# EAGLE design Doorlock (EAGLE 9.1.3)
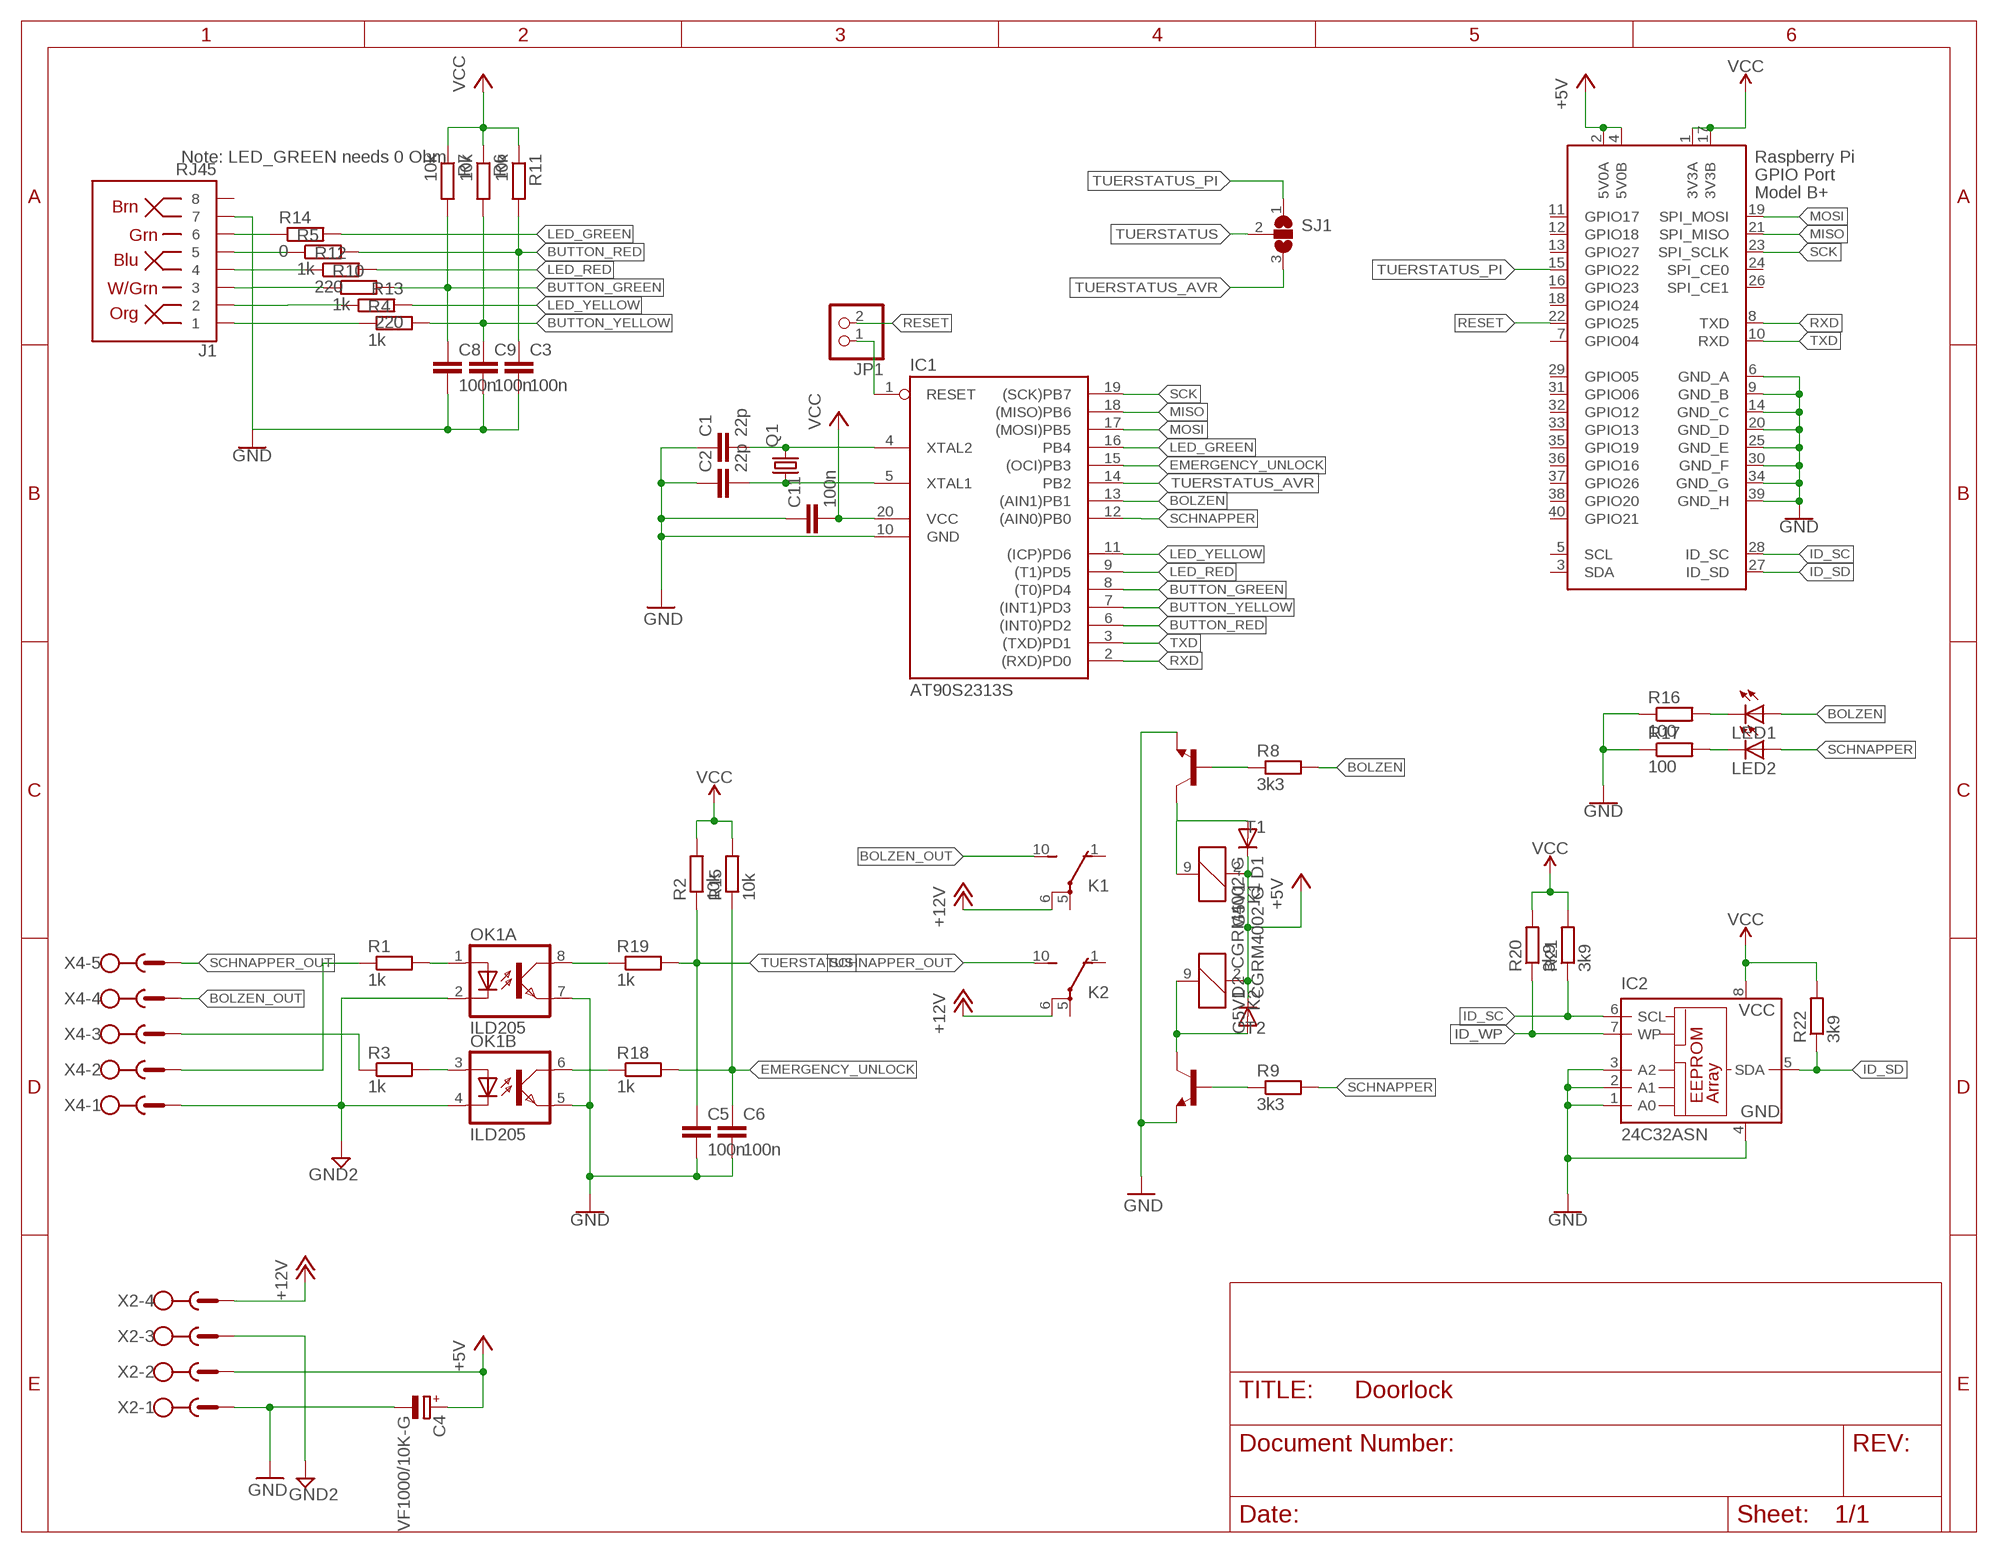
[diagram p0: schematic, sheet 1]

## Parts
C1  22p  C-EUC0805  [C0805]
C2  22p  C-EUC0805  [C0805]
C3  100n  C-EUC0805  [C0805]
C4  VF1000/10K-G  CPOL-EUUD-10X10  [UD-10X10_NICHICON]
C5  100n  C-EUC0805  [C0805]
C6  100n  C-EUC0805  [C0805]
C8  100n  C-EUC0805  [C0805]
C9  100n  C-EUC0805  [C0805]
C11  100n  C-EUC0805  [C0805]
D1  CGRM4002-G  [SOD-123_MINI-SMA]
D2  CGRM4002-G  [SOD-123_MINI-SMA]
IC1  AT90S2313S  [SO20L]
IC2  24C32ASN  [SO-08]
J1  RJ45  RJ45-8  [RJ45-8]
JP1  PINHD-1X2  [1X02]
K1  G5V1  [G5V1]
K2  G5V1  [G5V1]
LED1  LEDCHIP-LED0805  [CHIP-LED0805]
LED2  LEDCHIP-LED0805  [CHIP-LED0805]
OK1  ILD205  [SOIC08]
Q1  CRYSTALHC49UP  [HC49UP]
R1  1k  R-EU_R0805  [R0805]
R2  10k  R-EU_R0805  [R0805]
R3  1k  R-EU_R0805  [R0805]
R4  1k  R-EU_R0805  [R0805]
R5  1k  R-EU_R0805  [R0805]
R6  10k  R-EU_R0805  [R0805]
R7  10k  R-EU_R0805  [R0805]
R8  3k3  R-EU_R0805  [R0805]
R9  3k3  R-EU_R0805  [R0805]
R10  1k  R-EU_R0805  [R0805]
R11  10k  R-EU_R0805  [R0805]
R12  220  R-EU_R0805  [R0805]
R13  220  R-EU_R0805  [R0805]
R14  0  R-EU_R0805  [R0805]
R15  10k  R-EU_R0805  [R0805]
R16  100  R-EU_R0805  [R0805]
R17  100  R-EU_R0805  [R0805]
R18  1k  R-EU_R0805  [R0805]
R19  1k  R-EU_R0805  [R0805]
R20  3k9  R-EU_R0805  [R0805]
R21  3k9  R-EU_R0805  [R0805]
R22  3k9  R-EU_R0805  [R0805]
SJ1  SJ2W  [SJ_2]
T1  BC817-16-NPN-SOT23-BEC  [SOT23-BEC]
T2  BC817-16-NPN-SOT23-BEC  [SOT23-BEC]
X1  RASPI_BOARD_B+#_H  [RASPI_BOARD_B+HAT]
X2  RIA182-04  [RIA182-04]
X4  RIA182-05  [RIA182-05]

## Nets
+5V: C4.+ D1.C D2.C K1.2 K2.2 X1.2(5V0A) X1.4(5V0B) X2.2
+12V: K1.6(2:P) K2.6(2:P) X2.4
BOLZEN: IC1.13((AIN1)PB1) LED1.A R8.2
BOLZEN_OUT: K1.10(2:S) X4.4
BUTTON_GREEN: C8.1 IC1.8((T0)PD4) R7.2 R10.2
BUTTON_RED: C3.1 IC1.6((INT0)PD2) R5.2 R11.2
BUTTON_YELLOW: C9.1 IC1.7((INT1)PD3) R4.2 R6.2
EMERGENCY_UNLOCK: C6.1 IC1.15((OCI)PB3) R15.1 R18.2
GND: C1.1 C2.1 C3.2 C4.- C5.2 C6.2 C8.2 C9.2 C11.1 IC1.10(GND) IC2.1(A0) IC2.2(A1) IC2.3(A2) IC2.4(GND) J1.7 OK1.5(B:EMIT) OK1.7(A:EMIT) R16.1 R17.1 T1.E T2.E X1.6(GND_A) X1.9(GND_B) X1.14(GND_C) X1.20(GND_D) X1.25(GND_E) X1.30(GND_F) X1.34(GND_G) X1.39(GND_H) X2.1
GND2: OK1.2(A:C) OK1.4(B:C) X2.3 X4.1
ID_SC: IC2.6(SCL) R21.1 X1.28(ID_SC)
ID_SD: IC2.5(SDA) R22.1 X1.27(ID_SD)
ID_WP: IC2.7(WP) R20.1
LED_GREEN: IC1.16(PB4) R14.2
LED_RED: IC1.9((T1)PD5) R12.2
LED_YELLOW: IC1.11((ICP)PD6) R13.1
MISO: IC1.18((MISO)PB6) X1.21(SPI_MISO)
MOSI: IC1.17((MOSI)PB5) X1.19(SPI_MOSI)
N$1: IC1.1(RESET) JP1.1
N$2: J1.6 R14.1
N$3: OK1.6(B:COL) R18.1
N$4: OK1.3(B:A) R3.2
N$5: OK1.8(A:COL) R19.1
N$6: C1.2 IC1.4(XTAL2) Q1.2
N$7: C2.2 IC1.5(XTAL1) Q1.1
N$8: J1.3 R10.1
N$9: J1.4 R12.1
N$10: R1.1 X4.2
N$11: J1.2 R13.2
N$13: R3.1 X4.3
N$14: OK1.1(A:A) R1.2
N$16: LED1.C R16.2
N$17: LED2.C R17.2
N$20: J1.1 R4.1
N$21: J1.5 R5.1
N$24: D2.A K2.9 T2.C
N$25: D1.A K1.9 T1.C
N$27: R8.1 T1.B
N$28: R9.1 T2.B
RESET: JP1.2 X1.22(GPIO25)
RXD: IC1.2((RXD)PD0) X1.8(TXD)
SCHNAPPER: IC1.12((AIN0)PB0) LED2.A R9.2
SCHNAPPER_OUT: K2.10(2:S) X4.5
SCK: IC1.19((SCK)PB7) X1.23(SPI_SCLK)
TUERSTATUS: C5.1 R2.1 R19.2 SJ1.2
TUERSTATUS_AVR: IC1.14(PB2) SJ1.3
TUERSTATUS_PI: SJ1.1 X1.15(GPIO22)
TXD: IC1.3((TXD)PD1) X1.10(RXD)
VCC: C11.2 IC1.20(VCC) IC2.8(VCC) R2.2 R6.1 R7.1 R11.1 R15.2 R20.2 R21.2 R22.2 X1.1(3V3A) X1.17(3V3B)
Unconnected: J1.8 K1.1(2:O) K1.5(2:P) K2.1(2:O) K2.5(2:P) X1.3(SDA) X1.5(SCL) X1.7(GPIO04) X1.11(GPIO17) X1.12(GPIO18) X1.13(GPIO27) X1.16(GPIO23) X1.18(GPIO24) X1.24(SPI_CE0) X1.26(SPI_CE1) X1.29(GPIO05) X1.31(GPIO06) X1.32(GPIO12) X1.33(GPIO13) X1.35(GPIO19) X1.36(GPIO16) X1.37(GPIO26) X1.38(GPIO20) X1.40(GPIO21)

## Notes on the sheet
- Note: LED_GREEN needs 0 Ohm

## Library data of the parts
C1-C3 C5 C6 C8 C9 C11 = rcl:C-EU: CAPACITOR, European symbol
C4 = rcl:CPOL-EU: POLARIZED CAPACITOR, European symbol
D1 D2 = diode:CGRM400*-G: Molded plasitc,JEDEC SOD-123/Mini SMA Source: Comchip CGRM4001-G.pdf
IC1 = atmel:AT90S2313: MICROCONTROLLER 2 Kbytes FLASH 128 bytes SRAM 128 bytes EEPROM UART; OC_FARNELL: unknown; OC_NEWARK: unknown
IC2 = microchip:24*: Serial EEPROM I2C; MPN: IS24C32A-2GLI; OC_FARNELL: 1224413; OC_NEWARK: 43M4588
J1 = SparkFun-Connectors:RJ45-8: RJ45 Jack - 8 pin Simple RJ45, 8-pin connection. Commonly used for Cat5, Cat5e, and Cat6 Ethernet cables. Here is the connector we sell at SparkFun: RJ45 8-Pin Connector <https://www.sparkfun.com/products/643> (PRT-00643) Datasheet <https://cdn.sparkfun.com/datasheets/Prototyping/04908.pdf> It is used on this SparkFun product: SparkFun RJ45 Breakout <https://www.sparkfun.com/products/716> (BOB-00716) Note, you may also be interested in the "MAGJACK" version of this. It is basically a RJ45 connector, but also has some status LEDs built into the connector housing. You can check that out in this library at the device named "MAGJACK.dev" and see these products online: RJ45 Ethernet MagJack-Compatible <https://www.sparkfun.com/products/8534> (PRT-08534) SparkFun RJ45 MagJack Breakout <https://www.sparkfun.com/products/13021> (BOB-13021); PROD_ID: CONN-08506; SF_ID: PRT-00643
JP1 = pinhead:PINHD-1X2: PIN HEADER
K1 K2 = relay:G5V1: RELAY 1 x switch, 0.5 A/125 V AC, 1 A/24 V DC , Omron; MPN: G5V-1-DC24; OC_FARNELL: 9949593; OC_NEWARK: 36M6377
LED1 LED2 = led:LED: LED OSRAM: - CHIPLED LG R971, LG N971, LY N971, LG Q971, LY Q971, LO R971, LY R971 LH N974, LH R974 LS Q976, LO Q976, LY Q976 LO Q996 - Hyper CHIPLED LW Q18S LB Q993, LB Q99A, LB R99A - SideLED LS A670, LO A670, LY A670, LG A670, LP A670 LB A673, LV A673, LT A673, LW A673 LH A674 LY A675 LS A676, LA A676, LO A676, LY A676, LW A676 LS A679, LY A679, LG A679 - Hyper Micro SIDELED® LS Y876, LA Y876, LO Y876, LY Y876 LT Y87S - SmartLED LW L88C, LW L88S LB L89C, LB L89S, LG L890 LS L89K, LO L89K, LY L89K LS L896, LA L896, LO L896, LY L896 - TOPLED LS T670, LO T670, LY T670, LG T670, LP T670 LSG T670, LSP T670, LSY T670, LOP T670, LYG T670 LG T671, LOG T671, LSG T671 LB T673, LV T673, LT T673, LW T673 LH T674 LS T676, LA T676, LO T676, LY T676, LB T676, LH T676, LSB T676, LW T676 LB T67C, LV T67C, LT T67C, LS T67K, LO T67K, LY T67K, LW E67C LS E67B, LA E67B, LO E67B, LY E67B, LB E67C, LV E67C, LT E67C LW T67C LS T679, LY T679, LG T679 LS T770, LO T770, LY T770, LG T770, LP T770 LB T773, LV T773, LT T773, LW T773 LH T774 LS E675, LA E675, LY E675, LS T675 LS T776, LA T776, LO T776, LY T776, LB T776 LHGB T686 LT T68C, LB T68C - Hyper Mini TOPLED® LB M676 - Mini TOPLED Santana® LG M470 LS M47K, LO M47K, LY M47K Source: http://www.osram.convergy.de LUXEON: - LUMILED® LXK2-PW12-R00, LXK2-PW12-S00, LXK2-PW14-U00, LXK2-PW14-V00 LXK2-PM12-R00, LXK2-PM12-S00, LXK2-PM14-U00 LXK2-PE12-Q00, LXK2-PE12-R00, LXK2-PE12-S00, LXK2-PE14-T00, LXK2-PE14-U00 LXK2-PB12-K00, LXK2-PB12-L00, LXK2-PB12-M00, LXK2-PB14-N00, LXK2-PB14-P00, LXK2-PB14-Q00 LXK2-PR12-L00, LXK2-PR12-M00, LXK2-PR14-Q00, LXK2-PR14-R00 LXK2-PD12-Q00, LXK2-PD12-R00, LXK2-PD12-S00 LXK2-PH12-R00, LXK2-PH12-S00 LXK2-PL12-P00, LXK2-PL12-Q00, LXK2-PL12-R00 Source: www.luxeon.com KINGBRIGHT: KA-3528ASYC Source: www.kingbright.com
OK1 = optocoupler:ILD2*: Siemens ILD205/206/207/211/213/217 DUAL PHOTOTRANSISTOR SMALL OUTLINE SURFACE MOUNT OPTOCOUPLER Source: 153385-da-01-en-Optocoupler_ILD205-T.pdf; MF: VISHAY/TELEFUNKEN; MPN: ILD205T; OC_FARNELL: 1469512; OC_NEWARK: 20H8678
Q1 = crystal:CRYSTAL: CRYSTAL; OC_FARNELL: unknown; OC_NEWARK: unknown
R1-R22 = rcl:R-EU_: RESISTOR, European symbol
SJ1 = jumper:SJ2W: SMD solder JUMPER
T1 T2 = transistor:*-NPN-: NPN Transistror BF959 corrected 2008.03.06
X1 = raspberrypi_bastelstube_v13:RASPI_BOARD_B+#: Raspberry Pi GPIO connector with markings for the outer dimensions of the Raspberry Pi board model B+ with different sets of drill holes or mounting pads All pins connected
X2 = con-ria182:RIA182-04: Gewinkelter Wannenstecker 4-polig Rastermaß: 3,5mm Lötstift / Steckerstift: 1x1mm Bohrung: 1,5mm Bemessungsstrom: 5A Nennquerschnitt Stecker: 1,5qmm eindrähtig / 1qmm feinstdrähtig
X4 = con-ria182:RIA182-05: Gewinkelter Wannenstecker 5-polig Rastermaß: 3,5mm Lötstift / Steckerstift: 1x1mm Bohrung: 1,5mm Bemessungsstrom: 5A Nennquerschnitt Stecker: 1,5qmm eindrähtig / 1qmm feinstdrähtig

## Board
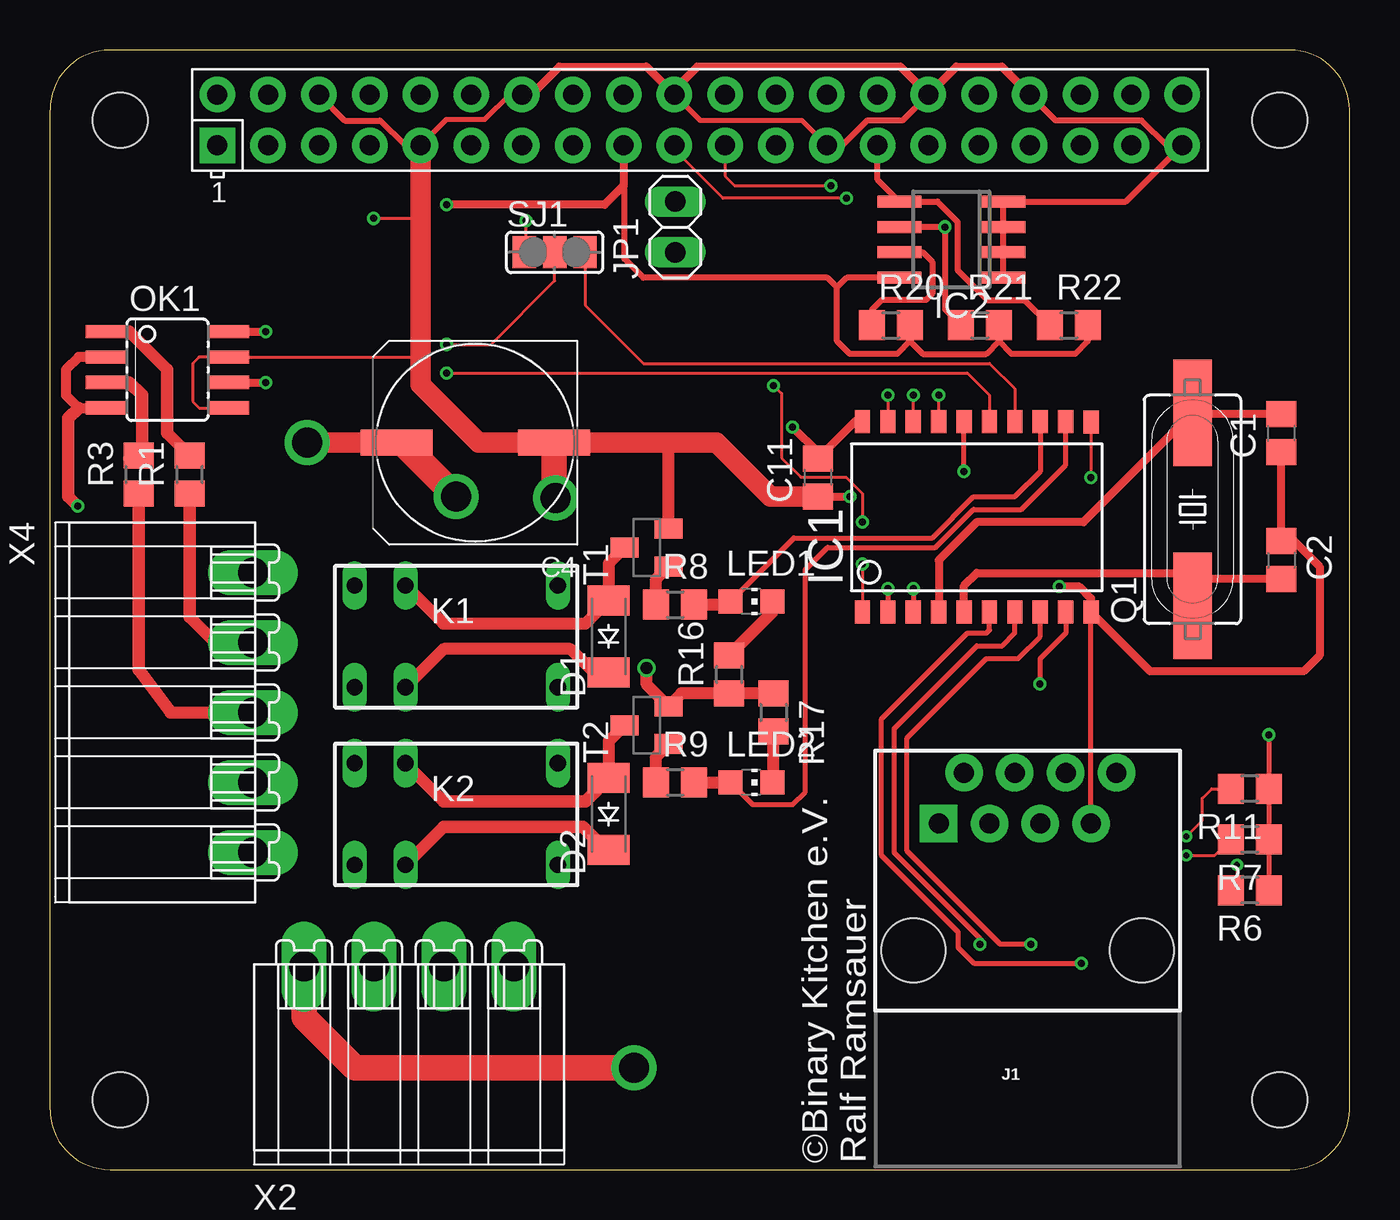
[diagram p1: board, top side]
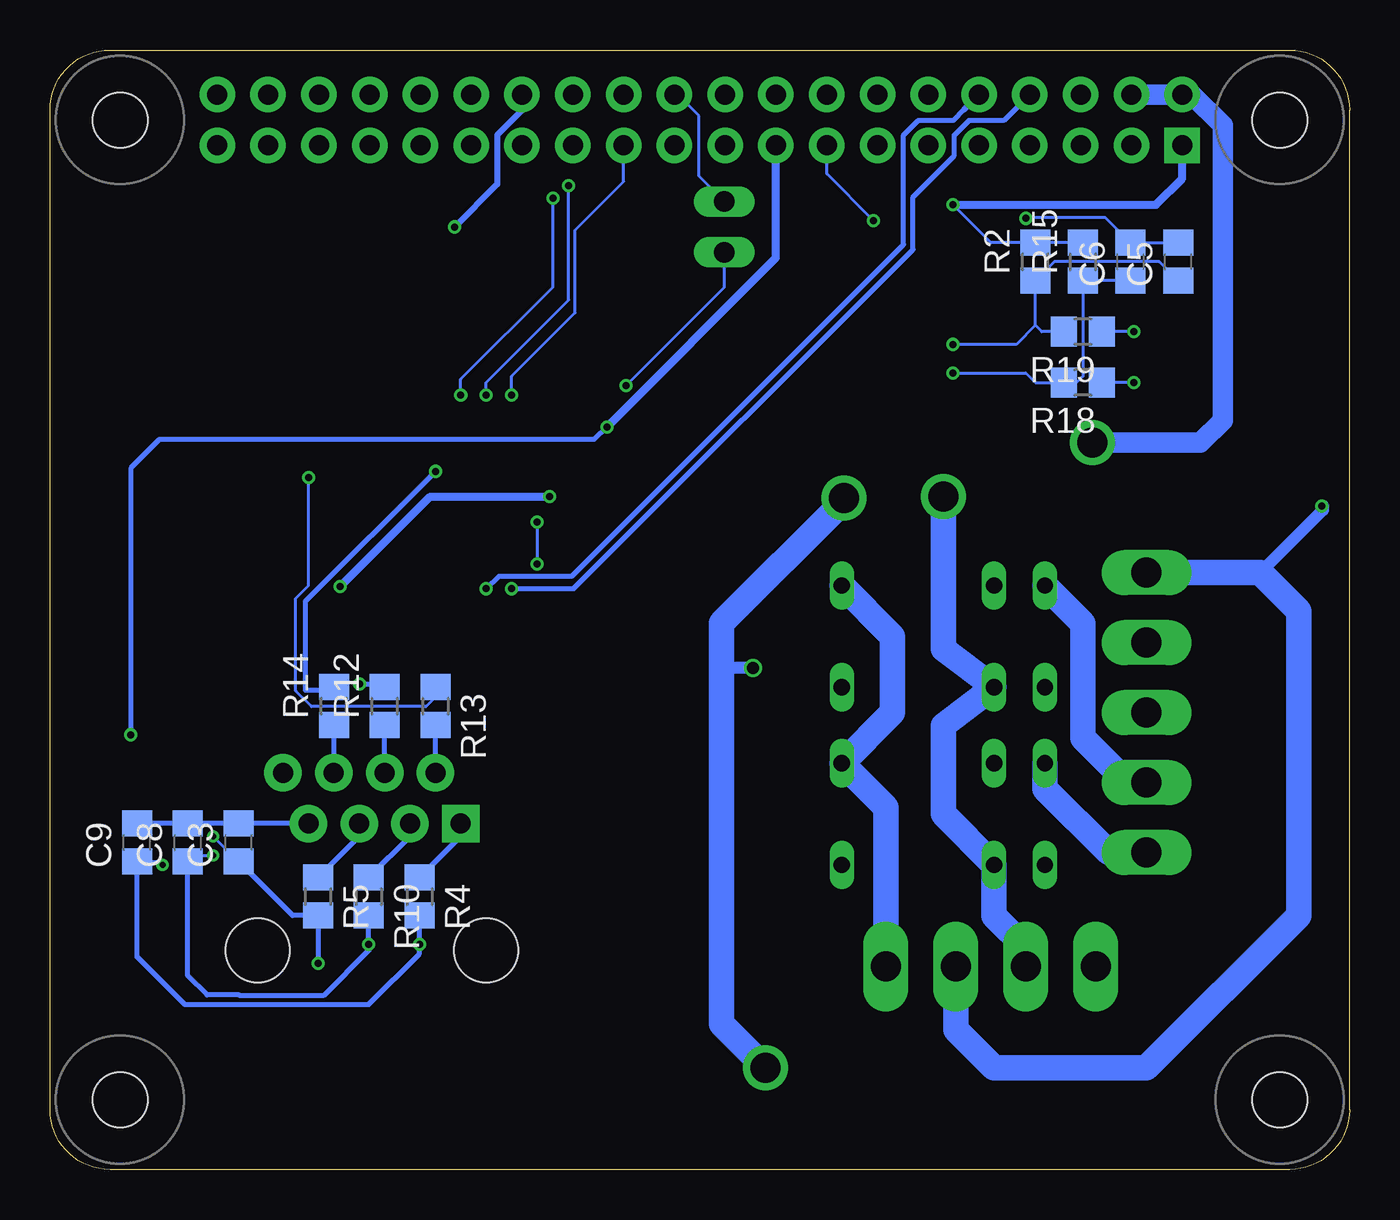
[diagram p2: board, bottom side, seen from below]

Size 65 x 56 mm. Coordinates in mm from the lower left corner, seen from the top.
Copper layers (1*16): Top 0.035mm / dielectric 1.6mm / Bottom 0.035mm
Design rules "Elecrow_2-layer_PCB_eagle_rule": minimum track width 6mil, minimum drill 12mil, track to track 6mil, track to pad 8mil, pad to pad 12mil, via to via 12mil, smd to smd 0mil, copper to edge 20mil, drill to drill 10mil, minimum pad ring 6mil, minimum via ring 6mil, stop-mask expansion 0mil, vias tented up to drill 100mil, thermal gap 10mil

### Footprints (pad centres in the part's own frame; a part is rotated, then mirrored left to right if it is on the bottom)
C0805 = smd 1.3 x 1.5: 1 -0.95,0; 2 0.95,0
UD-10X10_NICHICON = smd 3.6 x 1.3: + 3.925,0; - -3.95,0
SOD-123_MINI-SMA = smd 1.5 x 2.1: A 1.8,0; C -1.8,0
SO20L = smd 0.762 x 1.143: 1 -5.08,-5.131; 2 -3.81,-5.131; 3 -2.54,-5.131; 4 -1.27,-5.131; 5 0,-5.131; 6 1.27,-5.131; 7 2.54,-5.131; 8 3.81,-5.131; 9 5.08,-5.131; 10 6.35,-5.131; 11 6.35,4.369; 12 5.08,4.394; 13 3.81,4.394; 14 2.54,4.394; 15 1.27,4.394; 16 0,4.394; 17 -1.27,4.394; 18 -2.54,4.394; 19 -3.81,4.394; 20 -5.08,4.394
SO-08 = smd 0.6 x 2.2: 1 -1.905,-2.6; 2 -0.635,-2.6; 3 0.635,-2.6; 4 1.905,-2.6; 5 1.905,2.6; 6 0.635,2.6; 7 -0.635,2.6; 8 -1.905,2.6
RJ45-8 = drill 1 pad 1.88 square: 1 -4.445,6.35 | drill 1 pad 1.88: 2 -3.175,8.89; 3 -1.905,6.35; 4 -0.635,8.89; 5 0.635,6.35; 6 1.905,8.89; 7 3.175,6.35; 8 4.445,8.89 | hole 3.2: -5.715,0; 5.715,0
1X02 = drill 1.016 long: 1 -1.27,0; 2 1.27,0
G5V1 = drill 0.813 long: 1 -5.08,-2.54; 2 -2.54,-2.54; 5 5.08,-2.54; 6 5.08,2.54; 9 -2.54,2.54; 10 -5.08,2.54
CHIP-LED0805 = smd 1.2 x 1.2: A 0,-1.05; C 0,1.05
SOIC08 = smd 0.66 x 2.032: 1 -1.905,-3.073; 2 -0.635,-3.073; 3 0.635,-3.073; 4 1.905,-3.073; 5 1.905,3.073; 6 0.635,3.073; 7 -0.635,3.073; 8 -1.905,3.073
HC49UP = smd 5.334 x 1.93: 1 -4.826,0; 2 4.826,0
R0805 = smd 1.3 x 1.5: 1 -0.95,0; 2 0.95,0
SJ_2 = smd 1.168 x 1.6: 1 -1.524,0; 2 0,0; 3 1.524,0
SOT23-BEC = smd 1 x 1.4: B -0.95,-1.1; C 0,1.1; E 0.95,-1.1
RASPI_BOARD_B+HAT = drill 1 pad 1.778 square: 1 8.37,51.23 | drill 1 pad 1.778: 2 8.37,53.77; 3 10.91,51.23; 4 10.91,53.77; 5 13.45,51.23; 6 13.45,53.77; 7 15.99,51.23; 8 15.99,53.77; 9 18.53,51.23; 10 18.53,53.77; 11 21.07,51.23; 12 21.07,53.77; 13 23.61,51.23; 14 23.61,53.77; 15 26.15,51.23; 16 26.15,53.77; 17 28.69,51.23; 18 28.69,53.77; 19 31.23,51.23; 20 31.23,53.77; 21 33.77,51.23; 22 33.77,53.77; 23 36.31,51.23; 24 36.31,53.77; 25 38.85,51.23; 26 38.85,53.77; 27 41.39,51.23; 28 41.39,53.77; 29 43.93,51.23; 30 43.93,53.77; 31 46.47,51.23; 32 46.47,53.77; 33 49.01,51.23; 34 49.01,53.77; 35 51.55,51.23; 36 51.55,53.77; 37 54.09,51.23; 38 54.09,53.77; 39 56.63,51.23; 40 56.63,53.77 | hole 2.75: 3.5,3.5; 3.5,52.5; 61.5,3.5; 61.5,52.5
RIA182-04 = drill 1.5 long: 1 0,0; 2 3.5,0; 3 7,0; 4 10.5,0
RIA182-05 = drill 1.5 long: 1 -7,0; 2 -3.5,0; 3 0,0; 4 3.5,0; 5 7,0

### Placement (x,y rotation side)
C1  61.59,36.83 90 top
C2  61.59,30.48 270 top
C3  55.56,16.35 90 bottom
C4  21.27,36.35 180 top
C5  8.57,45.4 90 bottom
C6  10.95,45.4 90 bottom
C8  58.1,16.35 90 bottom
C9  60.64,16.35 90 bottom
C11  38.42,34.61 90 top
D1  27.94,26.67 90 top
D2  27.94,17.78 90 top
IC1  45.72,33.02 0 top
IC2  45.09,46.51 90 top
J1  48.9,10.95 0 top
JP1  31.27,47.15 90 top
K1  20.32,26.67 0 top
K2  20.32,17.78 0 top
LED1  35.08,28.42 270 top
LED2  35.08,19.37 270 top
OK1  5.87,40.01 270 top
Q1  57.15,33.02 90 top
R1  6.99,34.77 90 top
R2  15.72,45.4 90 bottom
R3  4.45,34.77 90 top
R4  46.51,13.65 270 bottom
R5  51.59,13.65 270 bottom
R6  60.01,13.97 180 top
R7  60.01,16.51 180 top
R8  31.27,28.26 0 top
R9  31.27,19.37 0 top
R10  49.05,13.65 270 bottom
R11  60.01,19.05 180 top
R12  48.26,23.18 90 bottom
R13  45.72,23.18 270 bottom
R14  50.8,23.18 90 bottom
R15  13.34,45.4 90 bottom
R16  33.97,24.77 90 top
R17  36.2,22.86 270 top
R18  13.34,39.37 180 bottom
R19  13.34,41.91 180 bottom
R20  42.07,42.23 0 top
R21  46.51,42.23 0 top
R22  50.96,42.23 0 top
SJ1  25.24,45.88 0 top
T1  29.84,31.11 90 top
T2  29.84,22.23 90 top
X1  0,0 0 top
X2  12.7,10.16 0 top
X4  10.16,22.86 270 top

### Tracks (layer width: path | path; a pad name or v marks a point on that pad's centre or on a via)
+5V  (via drill 1.5)
  Top 0.508: D1.C 27.2,24.87
  Top 0.61: 27.2,24.87 26.04,26.04 19.68,26.04 K1.2
  Top 0.635: D2.C 27.84,15.98 26.67,17.14 19.68,17.14 K2.2
  Top 1.016: v12.86,36.35 C4.+
  Top 1.27: v20.32,33.66 17.62,36.35 C4.+
  Bottom 1.016: v12.86,36.35 7.46,36.35 6.35,37.47 6.35,52.23 7.89,53.77 X1.2 X1.4
  Bottom 1.27: X2.2 16.2,11.12 17.78,12.7 K2.2 20.32,17.78 20.32,22.23 K1.2 20.32,26.04 v20.32,33.66
+12V
  Bottom 1.27: X2.4 23.2,18.12 K2.6 22.86,22.86 22.86,26.67 K1.6
BOLZEN
  Top 0.254: IC1.13 49.53,34.92 48.26,33.66 46.2,33.66 44.13,31.59 37.21,31.59 33.88,28.26
  Top 0.61: R8.2 33.88,28.26 LED1.A
BOLZEN_OUT
  Bottom 1.27: K1.10 13.34,27.3 13.34,21.59 11.11,19.36 X4.4
BUTTON_GREEN  (via drill 0.3, 0.35)
  Top 0.152: v56.83,15.72 58.26,15.72 R7.2
  Top 0.254: v49.05,11.27 47.53,11.27 42.86,15.94 42.86,21.59 46.83,25.56 48.42,25.56 49.53,26.67 IC1.8
  Bottom 0.152: C8.1 57.79,15.72 v56.83,15.72
  Bottom 0.254: C8.1 58.1,9.68 57.15,8.73 55.55,8.73 55.54,8.72 51.29,8.72 49.05,10.95 v49.05,11.27 R10.2
BUTTON_RED  (via drill 0.3, 0.35)
  Top 0.152: v56.83,16.67 57.63,17.46 57.63,18.57 58.1,19.05 R11.2
  Top 0.254: v51.59,10.32 46.21,10.32 45.41,11.11 45.41,11.88 41.59,15.7 41.59,22.54 45.88,26.83 46.83,26.83 46.99,26.99 IC1.6
  Bottom 0.152: C3.1 v56.83,16.67
  Bottom 0.254: C3.1 52.86,12.7 R5.2 v51.59,10.32
BUTTON_YELLOW  (via drill 0.3, 0.35)
  Top 0.152: v59.37,15.24 59.37,14.29 R6.2
  Top 0.254: v46.51,11.27 46.51,11.55 42.23,15.84 42.23,22.07 46.35,26.19 47.62,26.19 48.26,26.83 IC1.7
  Bottom 0.152: C9.1 59.53,15.4 v59.37,15.24
  Bottom 0.254: C9.1 60.64,10.64 58.26,8.26 49.05,8.26 46.51,10.79 v46.51,11.27 R4.2
EMERGENCY_UNLOCK  (via drill 0.35)
  Top 0.152: IC1.15 46.99,38.73 45.88,39.85 v19.84,39.85
  Bottom 0.152: C6.1 R15.1 13.34,39.69 13.65,39.37 R18.2 15.72,39.37 16.19,39.85 v19.84,39.85
GND  (via drill 0.35, 0.6, 1.5)
  Top 0.152: v16.19,47.58 18.48,47.58 18.53,47.62 | OK1.5 7.46,38.1 7.14,38.42 7.14,40.32 7.46,40.64 OK1.7 18.53,40.64
  Top 0.254: X1.9 19.83,52.53 21.74,52.53 22.98,53.77 | X1.25 37.61,52.47 32.53,52.47 X1.20 | J1.7 IC1.10
  Top 0.305: X1.6 14.74,52.48 16.51,52.48 17.75,51.23 X1.9 | 22.98,53.77 X1.14 24.08,53.77 | IC2.1 IC2.2 IC2.3 IC2.4 53.82,48.42 X1.39 55.85,51.23 54.61,52.48 53.57,52.48 53.57,52.47 52.07,52.47 52.07,52.48 51.03,52.48 51.03,52.47 50.31,52.47 X1.34 | X1.30 42.63,52.48 40.87,52.48 39.63,51.23 X1.25
  Top 0.406: C1.1 C2.1 62.23,31.43 63.5,30.16 63.5,25.72 62.71,24.92 55.03,24.92 IC1.10 52.07,28.57 51.48,29.16 v50.48,29.16 | 24.08,53.77 25.48,55.17 29.83,55.17 X1.20 31.23,54.02 32.38,55.17 42.53,55.17 X1.30 45.33,55.17 47.61,55.17 X1.34 | C11.1 v40,33.66
  Top 0.61: v29.84,25.08 29.84,24.27 T2.E 31.59,23.82 R16.1 R17.1 | T1.E 30.95,36.34 30.96,36.35
  Top 1.016: X1.9 18.53,47.62 18.53,40.64 18.53,39.26 21.43,36.35 C4.- 30.96,36.35 33.34,36.35 36.04,33.66 C11.1
  Top 1.27: X2.1 12.7,7.62 15.24,5.08 v29.21,5.08 | v25.29,33.58 25.22,33.64 C4.-
  Bottom 0.152: C5.2 C6.2 12.22,47.62 16.19,47.62 v16.19,47.58
  Bottom 0.254: J1.7 C3.2 C8.2 C9.2
  Bottom 0.406: v50.48,29.16 45.99,33.66 v40,33.66
  Bottom 0.61: v29.84,25.08 31.25,25.08 31.41,25.24
  Bottom 1.27: v25.29,33.58 25.29,33.45 31.41,27.33 31.41,25.24 31.41,7.28 v29.21,5.08
GND2  (via drill 0.35)
  Top 0.508: OK1.2 1.43,40.64 0.79,40.01 0.79,39.37 0.79,38.73 1.43,38.1 OK1.4
  Top 0.635: 1.43,38.1 0.92,37.59 0.92,33.66 v1.39,33.18
  Bottom 0.635: 4.46,29.86 1.33,32.99 1.33,33.18 v1.39,33.18
  Bottom 1.27: X4.1 4.46,29.86 2.54,27.94 2.54,12.7 10.16,5.08 17.78,5.08 19.7,7 X2.3
ID_SC  (via drill 0.35)
  Top 0.305: IC2.6 v44.77,47.15 44.77,43.02 R21.1
  Bottom 0.305: X1.28 41.39,52.99 42.63,51.75 42.63,49.28 v44.77,47.15
ID_SD
  Top 0.305: X1.27 41.39,49.51 IC2.5 44.39,48.42 45.4,47.41 45.4,44.99 46.89,43.5 48.74,43.5 R22.1
ID_WP
  Top 0.305: IC2.7 43.66,45.88 44.13,45.4 44.13,43.81 43.81,43.5 41.59,43.5 41.12,43.02 R20.1
LED_GREEN  (via drill 0.35)
  Top 0.254: v45.72,34.92 IC1.16
  Bottom 0.254: v45.72,34.92 52.23,28.42 52.23,23.97 50.96,23.97 R14.2
LED_RED  (via drill 0.35)
  Top 0.254: IC1.9 50.8,26.83 49.52,25.55 v49.52,24.29
  Bottom 0.254: R12.2 48.42,24.29 v49.52,24.29
LED_YELLOW  (via drill 0.35)
  Top 0.152: IC1.11 v52.07,34.61
  Bottom 0.152: R13.1 45.72,23.63 46.2,23.16 51.92,23.16 52.7,23.95 52.7,28.57 52.07,29.21 v52.07,34.61
MISO  (via drill 0.35)
  Top 0.152: IC1.18 v43.18,38.73 | X1.21 33.77,49.69 34.25,49.21 v39.05,49.21
  Bottom 0.152: v43.18,38.73 43.18,39.37 39.05,43.5 v39.05,49.21
MOSI  (via drill 0.35)
  Top 0.152: IC1.17 v44.45,38.73 | v39.85,48.58 33.66,48.58 31.23,51 X1.19
  Bottom 0.152: v44.45,38.73 44.45,39.53 39.85,44.13 v39.85,48.58
N$1  (via drill 0.35)
  Top 0.152: v40.64,32.38 40.64,33.81 39.82,34.63 37.55,34.63 36.59,35.59 36.59,38.81 v36.2,39.21 | v40.64,30.29 IC1.1
  Bottom 0.152: v36.2,39.21 31.27,44.13 JP1.1 | v40.64,32.38 v40.64,30.29
N$2
  Bottom 0.254: J1.6 R14.1
N$3  (via drill 0.35)
  Top 0.406: OK1.6 v10.79,39.37
  Bottom 0.152: v10.79,39.37 R18.1
N$4
  Top 0.635: OK1.3 3.97,39.37 4.6,38.73 4.6,36.2 3.97,35.56 4.29,35.56 R3.2
N$5  (via drill 0.35)
  Top 0.406: OK1.8 v10.79,41.91
  Bottom 0.152: v10.79,41.91 R19.1
N$6
  Top 0.406: Q1.2 57.08,37.78 | IC1.4 44.45,30.48 46.35,32.38 51.69,32.38 56.96,37.66 57.08,37.78 | C1.2 57.08,37.78
N$7
  Top 0.406: IC1.5 45.72,29.21 46.35,29.84 57.15,29.84 | C2.2 57.47,29.53 57.15,29.84 | Q1.1 57.15,29.84
N$8
  Bottom 0.254: J1.3 46.99,16.67 R10.1
N$9
  Bottom 0.254: J1.4 R12.1
N$10
  Top 0.61: X4.2 8.26,26.36 6.99,27.63
  Top 0.635: 6.99,27.63 R1.1
N$11
  Bottom 0.254: J1.2 R13.2
N$13
  Top 0.61: 4.45,24.98 6.03,22.86 X4.3
  Top 0.635: R3.1 4.45,24.98
N$14
  Top 0.635: OK1.1 3.97,41.91 5.87,40.01 5.87,38.1 5.87,36.83 R1.2
N$16
  Top 0.61: R16.2 36.13,27.88 LED1.C
N$17
  Top 0.61: LED2.C 36.2,19.43 R17.2
N$20
  Bottom 0.254: J1.1 44.45,16.67 R4.1
N$21
  Bottom 0.254: J1.5 49.53,16.67 R5.1
N$24
  Top 0.61: T2.C 27.94,21.42 D2.A
  Top 0.635: K2.9 19.68,18.41 26.77,18.41 D2.A
N$25
  Top 0.61: K1.9 19.68,27.3 26.77,27.3 D1.A 27.94,30.31 T1.C
N$27
  Top 0.61: R8.1 30.32,29.54 T1.B
N$28
  Top 0.61: R9.1 30.32,20.65 T2.B
RESET
  Bottom 0.152: JP1.2 32.54,49.69 32.54,52.7 33.61,53.77 X1.22
RXD  (via drill 0.35)
  Top 0.254: v41.91,29.05 IC1.2
  Bottom 0.254: v41.91,29.05 38.8,29.05 21.84,46.02 21.84,48.65 19.77,50.71 19.77,51.74 19.05,52.47 17.29,52.47 X1.8
SCHNAPPER
  Top 0.254: IC1.12 50.8,35.24 48.58,33.02 46.2,33.02 44.29,31.11 38.89,31.11 37.78,30 37.78,18.89 37.15,18.26 35.15,18.26 LED2.A
  Top 0.61: R9.2 LED2.A
SCHNAPPER_OUT
  Bottom 1.27: X4.5 12.05,15.86 15.24,19.05 K2.10
SCK  (via drill 0.35)
  Top 0.152: v41.91,38.73 IC1.19
  Bottom 0.152: v41.91,38.73 41.91,39.69 38.73,42.86 38.73,46.99 36.31,49.41 X1.23
TUERSTATUS  (via drill 0.35)
  Top 0.152: v19.84,41.27 22.07,41.27 25.24,44.45 SJ1.2
  Bottom 0.152: R19.2 15.4,41.91 15.72,42.23 | 15.72,42.23 R2.1 14.76,45.4 9.52,45.4 C5.1 | 15.72,42.23 16.67,41.27 v19.84,41.27
TUERSTATUS_AVR
  Top 0.152: SJ1.3 26.77,43.24 29.69,40.32 46.99,40.32 48.26,39.05 IC1.14
TUERSTATUS_PI  (via drill 0.35)
  Top 0.152: SJ1.1 23.81,45.97 v23.81,47.47
  Bottom 0.152: v23.81,47.47 26.15,49.8 X1.15
TXD  (via drill 0.35)
  Top 0.254: v43.18,29.05 IC1.3
  Bottom 0.254: 19.27,53.03 19.83,52.47 21.59,52.47 22.31,51.74 22.31,46.27 38.89,29.69 42.55,29.69 v43.18,29.05
  Bottom 0.305: X1.10 19.27,53.03
VCC  (via drill 0.35)
  Top 0.254: R6.1 R7.1 R11.1 v60.96,21.75
  Top 0.305: IC2.8 39.85,44.61 39.37,44.13 | 28.69,49.21 28.73,49.17 28.73,45.56 29.69,44.61 38.89,44.61 39.37,44.13 | 47.46,41.43 46.83,40.8 43.65,40.8 43.02,41.43 R20.2 43.02,41.43 42.39,40.8 40.01,40.8 39.37,41.43 39.37,44.13 | 47.46,41.43 R21.2 | R22.2 51.91,41.44 51.91,41.43 51.28,40.8 48.1,40.8 47.46,41.43
  Top 0.406: v37.15,37.15 38.42,35.88 C11.2 40.27,37.41 IC1.20 | X1.17 28.69,49.21 27.74,48.26 v19.84,48.26
  Bottom 0.152: R15.2 R2.2 17.94,46.35 v19.84,48.26
  Bottom 0.254: v37.15,37.15 37.78,36.51 59.53,36.51 60.96,35.08 v60.96,21.75
  Bottom 0.406: v37.15,37.15 28.69,45.6 X1.17 | X1.1 8.37,49.57 9.68,48.26 v19.84,48.26

### Text on the board
tPlace: ©Binary Kitchen e.V. / Ralf Ramsauer